# EAGLE design servocontrol (EAGLE 6.0)
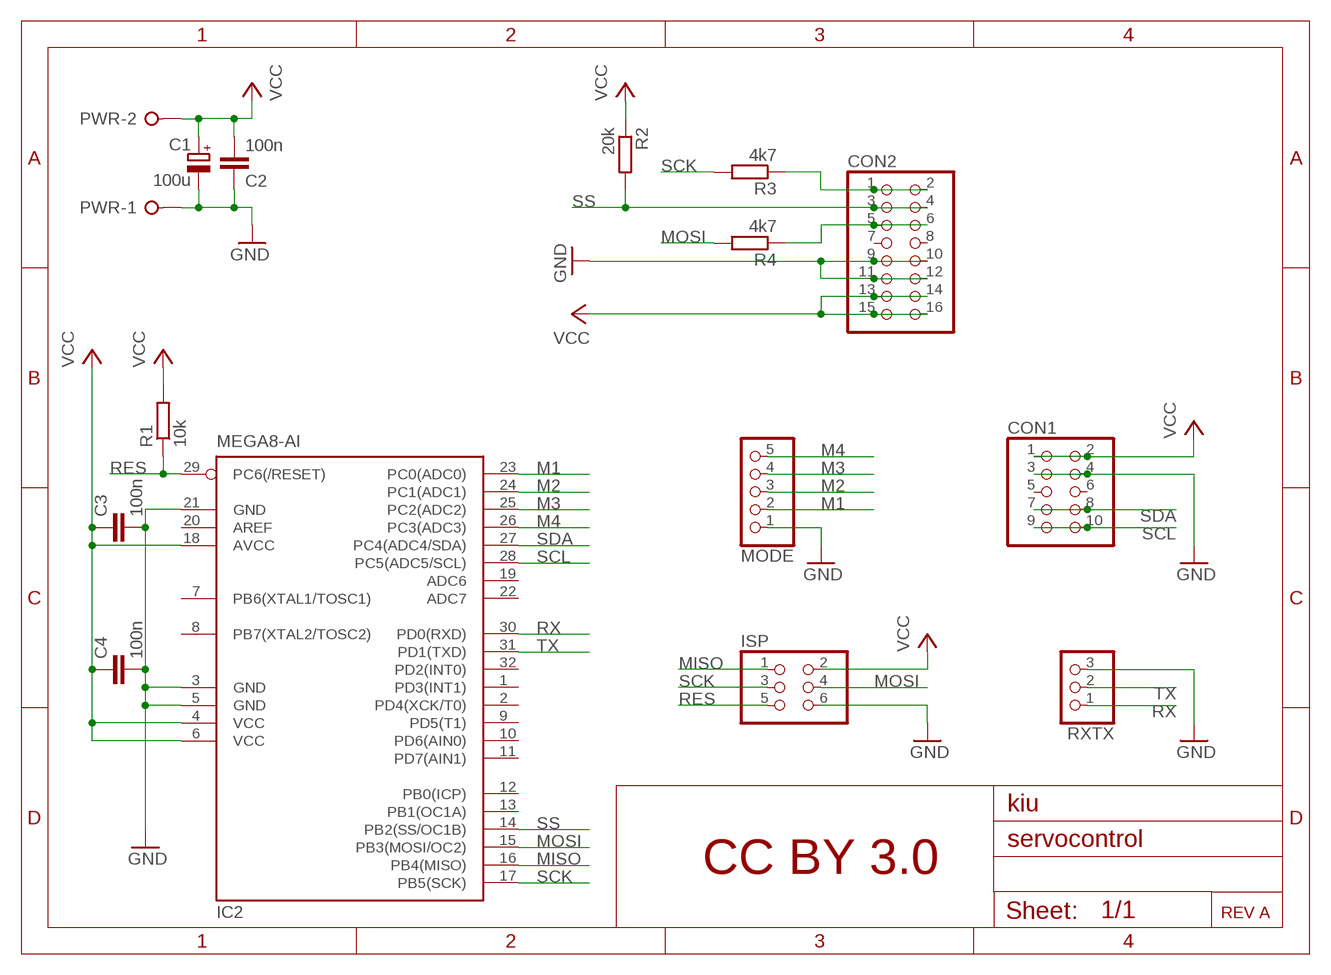
[diagram p0: schematic, sheet 1]

## Parts
C1  100u  CPOL-EU153CLV-0505  [153CLV-0505]
C2  100n  C-EUC0805  [C0805]
C3  100n  C-EUC0805  [C0805]
C4  100n  C-EUC0805  [C0805]
CON1  PINHD-2X5  [2X05]
CON2  PINHD-2X8  [2X08]
IC2  MEGA8-AI  [TQFP32-08]
ISP  PINHD-2X3  [2X03]
MODE  PINHD-1X5  [1X05]
PWR  W237-02P  [W237-132]
R1  10k  R-EU_R0805  [R0805]
R2  20k  R-EU_R0805  [R0805]
R3  4k7  R-EU_R0805  [R0805]
R4  4k7  R-EU_R0805  [R0805]
RXTX  PINHD-1X3  [1X03]

## Nets
GND: C1.- C2.1 C3.2 C4.2 CON1.3 CON1.4 CON2.9 CON2.10 CON2.11 CON2.12 IC2.3(GND) IC2.5(GND) IC2.21(GND) ISP.6 MODE.1 PWR.1 RXTX.3
M1: IC2.23(PC0(ADC0)) MODE.2
M2: IC2.24(PC1(ADC1)) MODE.3
M3: IC2.25(PC2(ADC2)) MODE.4
M4: IC2.26(PC3(ADC3)) MODE.5
MISO: IC2.16(PB4(MISO)) ISP.1
MOSI: IC2.15(PB3(MOSI/OC2)) ISP.4 R4.2
N$2: CON2.5 CON2.6 R4.1
N$5: CON2.1 CON2.2 R3.1
RES: IC2.29(PC6(/RESET)) ISP.5 R1.1
RX: IC2.30(PD0(RXD)) RXTX.1
SCK: IC2.17(PB5(SCK)) ISP.3 R3.2
SCL: CON1.9 CON1.10 IC2.28(PC5(ADC5/SCL))
SDA: CON1.7 CON1.8 IC2.27(PC4(ADC4/SDA))
SS: CON2.3 CON2.4 IC2.14(PB2(SS/OC1B)) R2.2
TX: IC2.31(PD1(TXD)) RXTX.2
VCC: C1.+ C2.2 C3.1 C4.1 CON1.1 CON1.2 CON2.13 CON2.14 CON2.15 CON2.16 IC2.4(VCC) IC2.6(VCC) IC2.18(AVCC) ISP.2 PWR.2 R1.2 R2.1
Unconnected: CON1.5 CON1.6 CON2.7 CON2.8 IC2.1(PD3(INT1)) IC2.2(PD4(XCK/T0)) IC2.7(PB6(XTAL1/TOSC1)) IC2.8(PB7(XTAL2/TOSC2)) IC2.9(PD5(T1)) IC2.10(PD6(AIN0)) IC2.11(PD7(AIN1)) IC2.12(PB0(ICP)) IC2.13(PB1(OC1A)) IC2.19(ADC6) IC2.20(AREF) IC2.22(ADC7) IC2.32(PD2(INT0))

## Notes on the sheet
- kiu
- CC BY 3.0
- REV A

## Library data of the parts
C1 = rcl:CPOL-EU: POLARIZED CAPACITOR, European symbol
C2-C4 = rcl:C-EU: CAPACITOR, European symbol
CON1 = pinhead:PINHD-2X5: PIN HEADER
CON2 = pinhead:PINHD-2X8: PIN HEADER
IC2 = atmel:MEGA8: MICROCONTROLLER 8 Kbytes FLASH, 1 kbytes SRAM, 512 bytes EEPROM, USART, 6-channel 10 bit ADC, 2-channel 8 bit ADC Pin compatible with Atmega48, ATMega88, ATMega168 Source: avr.lbr; MPN: ATMEGA8-16AU; OC_FARNELL: 9171371; OC_NEWARK: 73M8863
ISP = pinhead:PINHD-2X3: PIN HEADER
MODE = pinhead:PINHD-1X5: PIN HEADER
PWR = con-wago-508:W237-02P: WAGO SREW CLAMP; OC_FARNELL: unknown; OC_NEWARK: unknown
R1-R4 = rcl:R-EU_: RESISTOR, European symbol
RXTX = pinhead:PINHD-1X3: PIN HEADER

## Board
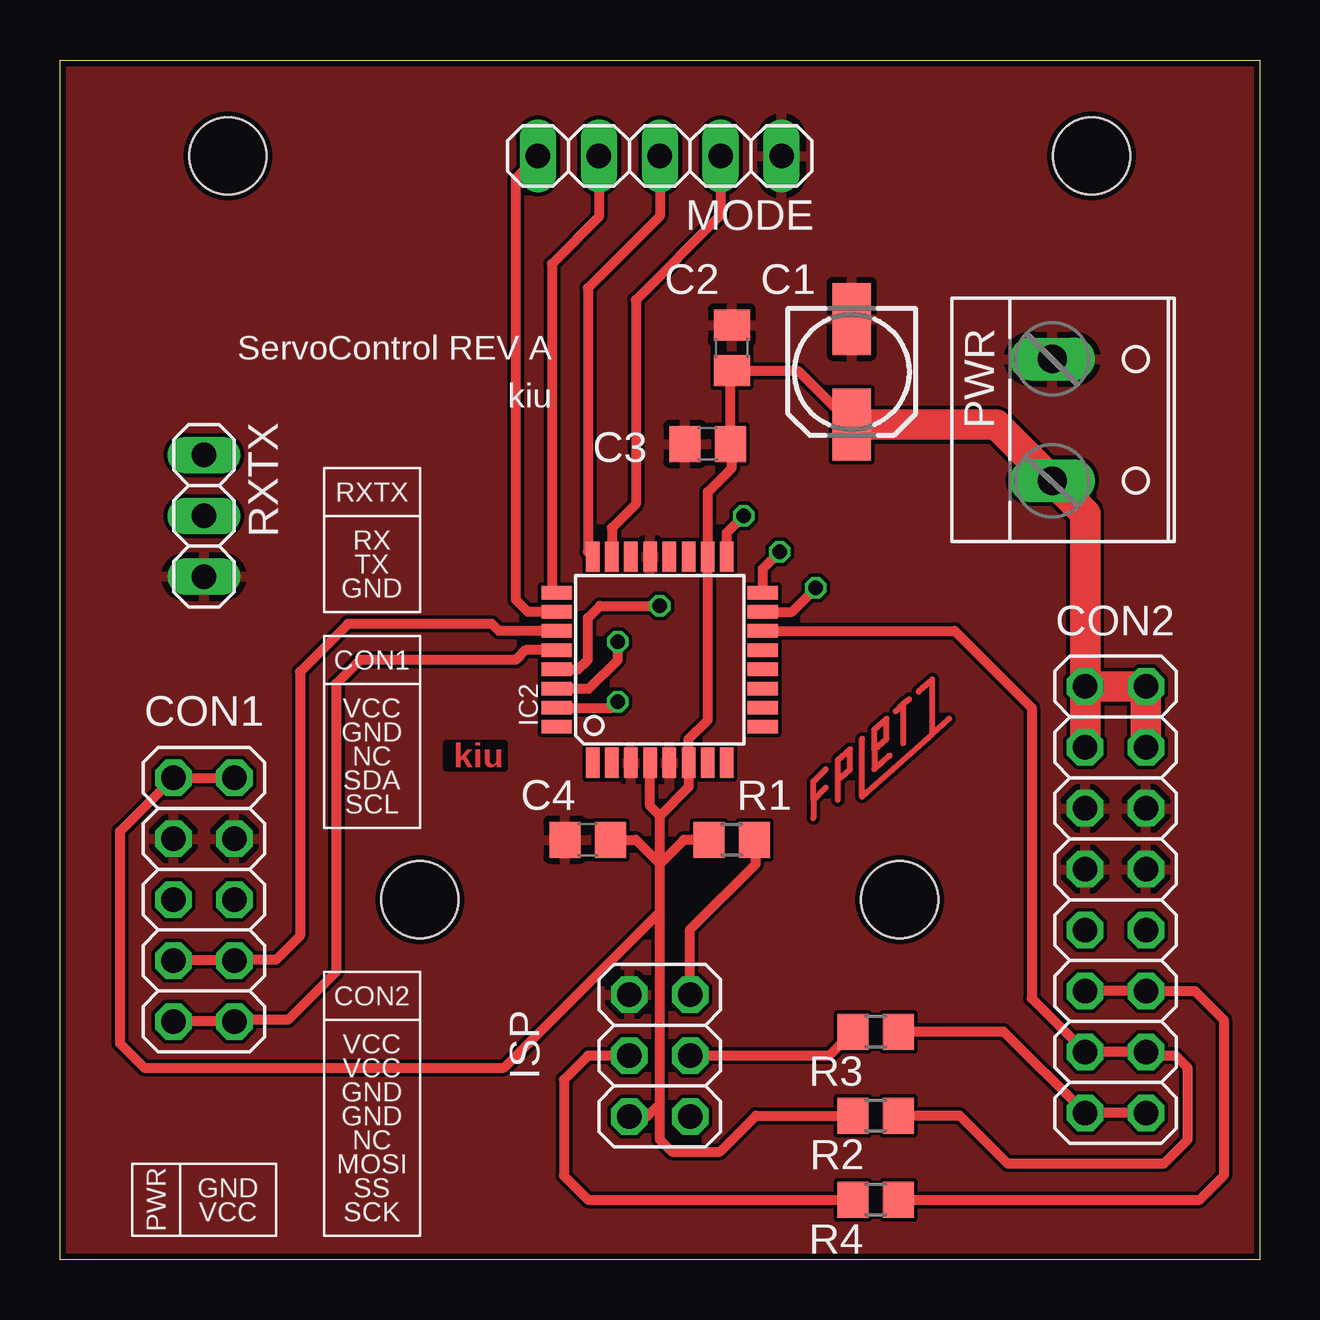
[diagram p1: board, top side]
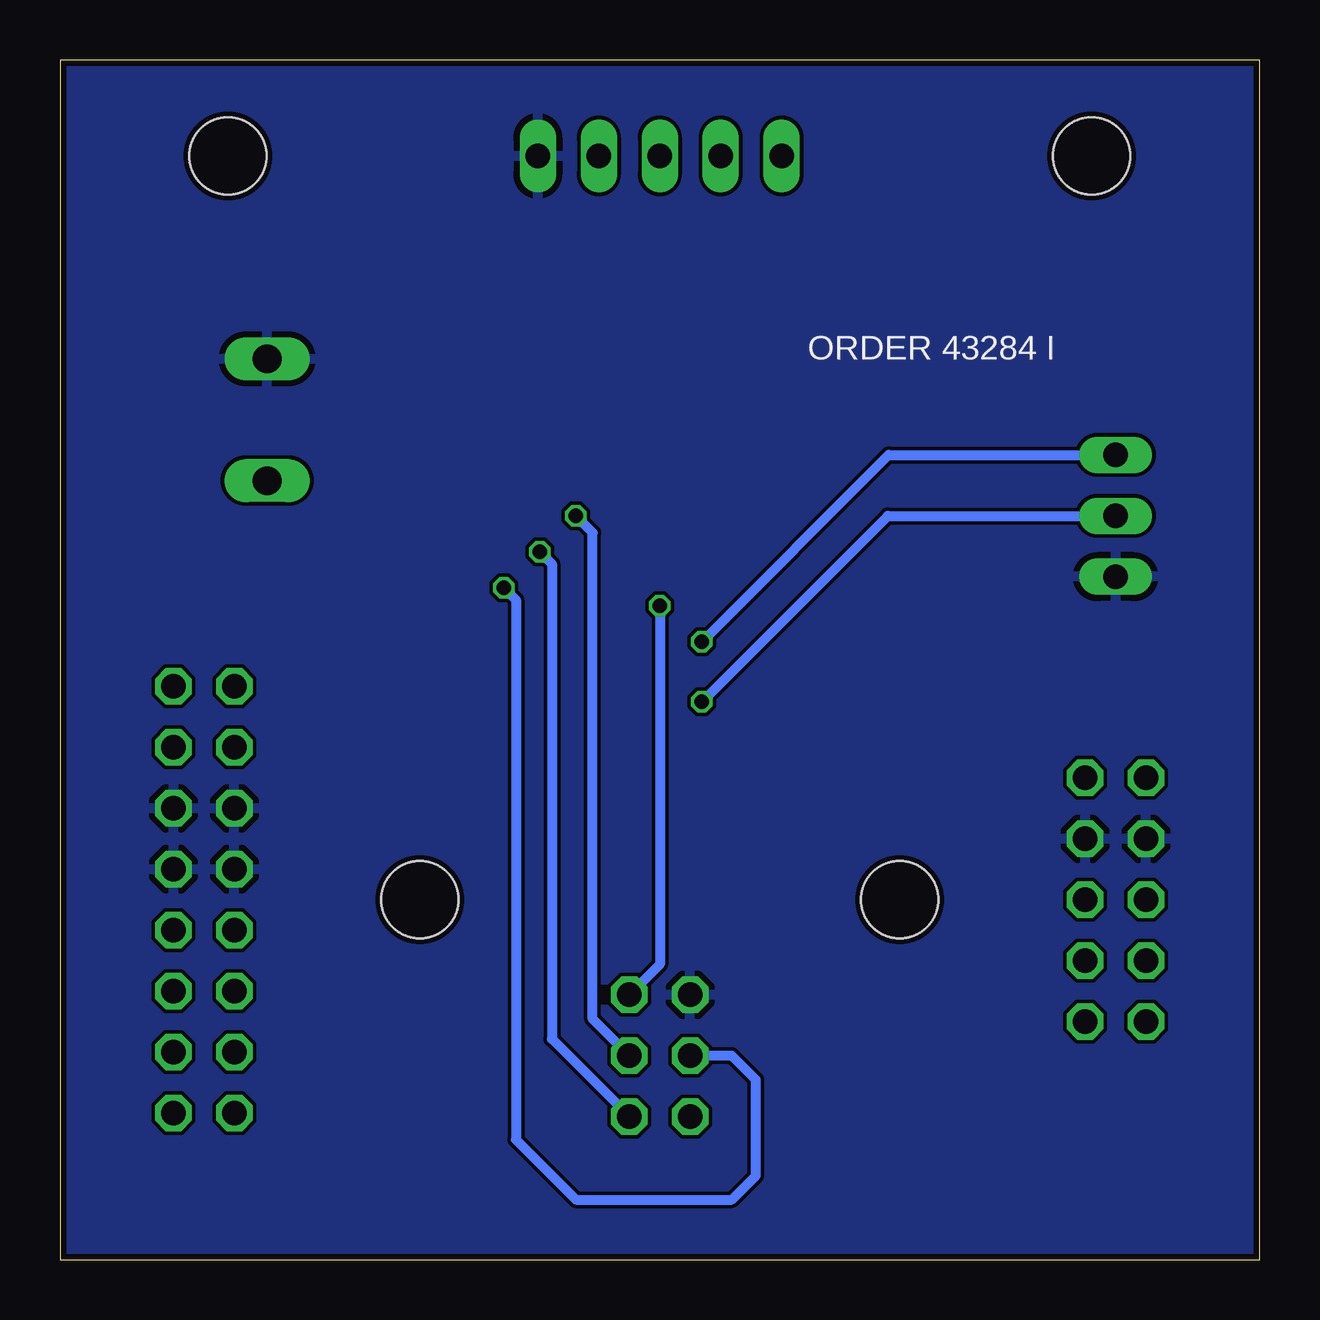
[diagram p2: board, bottom side, seen from below]

Size 50 x 50 mm. Coordinates in mm from the lower left corner, seen from the top.
Outline: 0,0 0,50 50,50 50,0 0,0
Copper layers (1*16): Top 0.035mm / dielectric 1.5mm / Bottom 0.035mm
Design rules: minimum track width 6mil, minimum drill 12mil, track to track 6mil, track to pad 6mil, pad to pad 6mil, via to via 6mil, smd to smd 0mil, copper to edge 10mil, drill to drill 10mil, minimum pad ring 10mil, minimum via ring 6mil, stop-mask expansion 2mil, vias tented up to drill 100mil, thermal gap 10mil
Holes 3.2 mm at 7,46 15,15 43,46 35,15

### Footprints (pad centres in the part's own frame; a part is rotated, then mirrored left to right if it is on the bottom)
153CLV-0505 = smd 3 x 1.6: + 2.2,0; - -2.2,0
C0805 = smd 1.3 x 1.5: 1 -0.95,0; 2 0.95,0
2X05 = drill 1.016 octagon: 1 -5.08,-1.27; 2 -5.08,1.27; 3 -2.54,-1.27; 4 -2.54,1.27; 5 0,-1.27; 6 0,1.27; 7 2.54,-1.27; 8 2.54,1.27; 9 5.08,-1.27; 10 5.08,1.27
2X08 = drill 1.016 octagon: 1 -8.89,-1.27; 2 -8.89,1.27; 3 -6.35,-1.27; 4 -6.35,1.27; 5 -3.81,-1.27; 6 -3.81,1.27; 7 -1.27,-1.27; 8 -1.27,1.27; 9 1.27,-1.27; 10 1.27,1.27; 11 3.81,-1.27; 12 3.81,1.27; 13 6.35,-1.27; 14 6.35,1.27; 15 8.89,-1.27; 16 8.89,1.27
TQFP32-08 = smd 1.27 x 0.559: 1 -4.293,2.8; 2 -4.293,2; 3 -4.293,1.2; 4 -4.293,0.4; 5 -4.293,-0.4; 6 -4.293,-1.2; 7 -4.293,-2; 8 -4.293,-2.8; 17 4.293,-2.8; 18 4.293,-2; 19 4.293,-1.2; 20 4.293,-0.4; 21 4.293,0.4; 22 4.293,1.2; 23 4.293,2; 24 4.293,2.8 | smd 0.559 x 1.27: 9 -2.8,-4.293; 10 -2,-4.293; 11 -1.2,-4.293; 12 -0.4,-4.293; 13 0.4,-4.293; 14 1.2,-4.293; 15 2,-4.293; 16 2.8,-4.293; 25 2.8,4.293; 26 2,4.293; 27 1.2,4.293; 28 0.4,4.293; 29 -0.4,4.293; 30 -1.2,4.293; 31 -2,4.293; 32 -2.8,4.293
2X03 = drill 1.016 octagon: 1 -2.54,-1.27; 2 -2.54,1.27; 3 0,-1.27; 4 0,1.27; 5 2.54,-1.27; 6 2.54,1.27
1X05 = drill 1.016 long: 1 -5.08,0; 2 -2.54,0; 3 0,0; 4 2.54,0; 5 5.08,0
W237-132 = drill 1.194 long: 1 -2.54,-0.635; 2 2.54,-0.635
R0805 = smd 1.3 x 1.5: 1 -0.95,0; 2 0.95,0
1X03 = drill 1.016 long: 1 -2.54,0; 2 0,0; 3 2.54,0

### Placement (x,y rotation side)
C1  33,37 270 top
C2  28,38 270 top
C3  27,34 180 top
C4  22,17.5 180 top
CON1  6,15 270 top
CON2  44,15 90 top
IC2  25,25 90 top
ISP  25,8.5 90 top
MODE  25,46 180 top
PWR  42,35 270 top
R1  28,17.5 180 top
R2  34,6 0 top
R3  34,9.5 180 top
R4  34,2.5 180 top
RXTX  6,31 270 top

### Tracks (layer width: path | path; a pad name or v marks a point on that pad's centre or on a via)
GND
  pour Bottom: -1,51 51,51 51,-1 -1,-1
  pour Top: -1,-1 51,-1 51,51 -1,51
M1
  Top 0.406: IC2.23 23,30.5 24,31.5 24,40 27.54,43.54 MODE.2
M2
  Top 0.406: MODE.3 25,43.5 22,40.5 22,29.49 IC2.24
M3
  Top 0.406: MODE.4 22.46,43.46 20.5,41.5 20.5,28.01 IC2.25
M4
  Top 0.406: IC2.26 19.5,27 19,27.5 19,45.08 MODE.5
MISO  (via drill 0.6)
  Top 0.406: IC2.16 29.29,28.79 v30,29.5
  Bottom 0.406: v30,29.5 29.5,29 29.5,9.19 ISP.1
MOSI  (via drill 0.6)
  Top 0.406: ISP.4 22,8.5 21,7.5 21,3.5 22,2.5 R4.2 | IC2.15 30.5,27 v31.5,28
  Bottom 0.406: v31.5,28 31,27.5 31,5 28.5,2.5 22,2.5 21,3.5 21,7.5 22,8.5 ISP.4
N$2
  Top 0.406: CON2.6 CON2.5 47.31,11.19 48.5,10 48.5,3.5 47.5,2.5 R4.1
N$5
  Top 0.406: CON2.1 CON2.2 39.34,9.5 R3.1
N$13
  Top 0.254: 32.42,19.99 32.42,20.82 32.93,21.26 32.93,20.44 32.42,19.99 | 32.42,19.17 32.42,19.99
N$14
  Top 0.254: 33.44,21.71 33.44,19.29 36.36,21.9 | 35.79,23.68 36.36,24.18 36.36,21.9 | 36.36,21.9 37.06,22.53
N$15
  Top 0.254: 34.58,21.01 33.94,20.44 33.94,21.26 | 33.94,21.26 33.94,22.09 34.45,22.53 34.45,21.71 33.94,21.26
N$16
  Top 0.254: 35.15,23.17 34.83,22.85 | 35.15,21.52 35.15,23.17 | 35.15,23.17 35.41,23.36
N$19
  Top 0.254: 31.91,20.44 31.4,19.93 31.4,19.17 | 31.4,19.17 31.4,18.4 | 31.4,19.17 31.91,19.67
RES  (via drill 0.6)
  Top 0.406: IC2.29 21.6,24.6 22,25 22,26.75 22.5,27.25 v25,27.25 | ISP.5 26.27,13.77 29,16.5 29,17.45 R1.1
  Bottom 0.406: v25,27.25 25,12.31 ISP.5
RX  (via drill 0.6)
  Top 0.406: IC2.30 22.05,23.8 23.25,25 v23.25,25.75
  Bottom 0.406: v23.25,25.75 15.46,33.54 RXTX.1
SCK  (via drill 0.6)
  Top 0.406: R3.2 32.05,8.5 ISP.3 | IC2.17 27.8,30.3 v28.5,31
  Bottom 0.406: v28.5,31 27.8,30.3 27.8,10.03 ISP.3
SCL
  Top 0.406: CON1.10 CON1.9 | CON1.10 7.35,10 9.5,10 11.5,12 11.5,24 12.5,25 19,25 19.4,25.4 IC2.28 | 7.5,9.69 CON1.10
SDA
  Top 0.406: CON1.7 CON1.8 7.31,12.5 9,12.5 10,13.5 10,24.5 12,26.5 18,26.5 18.3,26.2 IC2.27
SS
  Top 0.406: R2.2 37.5,6 39.5,4 46,4 47,5 47,8 46.5,8.5 45.42,8.5 CON2.3 CON2.4 40.5,10.88 40.5,23 37.3,26.2 IC2.14
TX  (via drill 0.6)
  Top 0.406: IC2.31 23,23 v23.25,23.25
  Bottom 0.406: v23.25,23.25 15.5,31 RXTX.2
VCC
  Top 0.406: CON1.2 CON1.1 2.5,17.85 2.5,9 3.5,8 18.5,8 25,14.5 | R2.1 29,6 27.5,4.5 25.5,4.5 25,5 25,6.5 | 25,6.5 25,14.5 | 25,14.5 25,16.5 | 25,16.5 25,18.5 | C1.+ 30.75,37.05 C2.2 27.95,37 C3.1 28,33.95 28,33 27,32 IC2.18 27,22.5 26.2,21.7 IC2.6 26.2,19.7 25,18.5 | 25,18.5 24.6,18.9 IC2.4 | ISP.2 24.46,5.96 25,6.5 | C4.1 24,17.5 25,16.5 | R1.2 26,17.5 25,16.5
  Top 1.27: CON2.16 CON2.14 | CON2.16 CON2.15 CON2.13 | CON2.16 42.73,31.09 PWR.2 39.02,34.8 C1.+

### Text on the board
Top: kiu
tNames: ServoControl REV A | kiu | RXTX | RX | TX | GND | CON1 | VCC | GND | NC | SDA | SCL | CON2 | VCC | VCC | GND | GND | NC | MOSI | GND | SS | PWR | VCC | SCK
bNames: ORDER 43284 I